# Altium schematic sheet [01]-COVER PAGE.SchDoc: S32K1_CONTROLLER
size A3; SheetNumber: 01; SheetTotal: 11
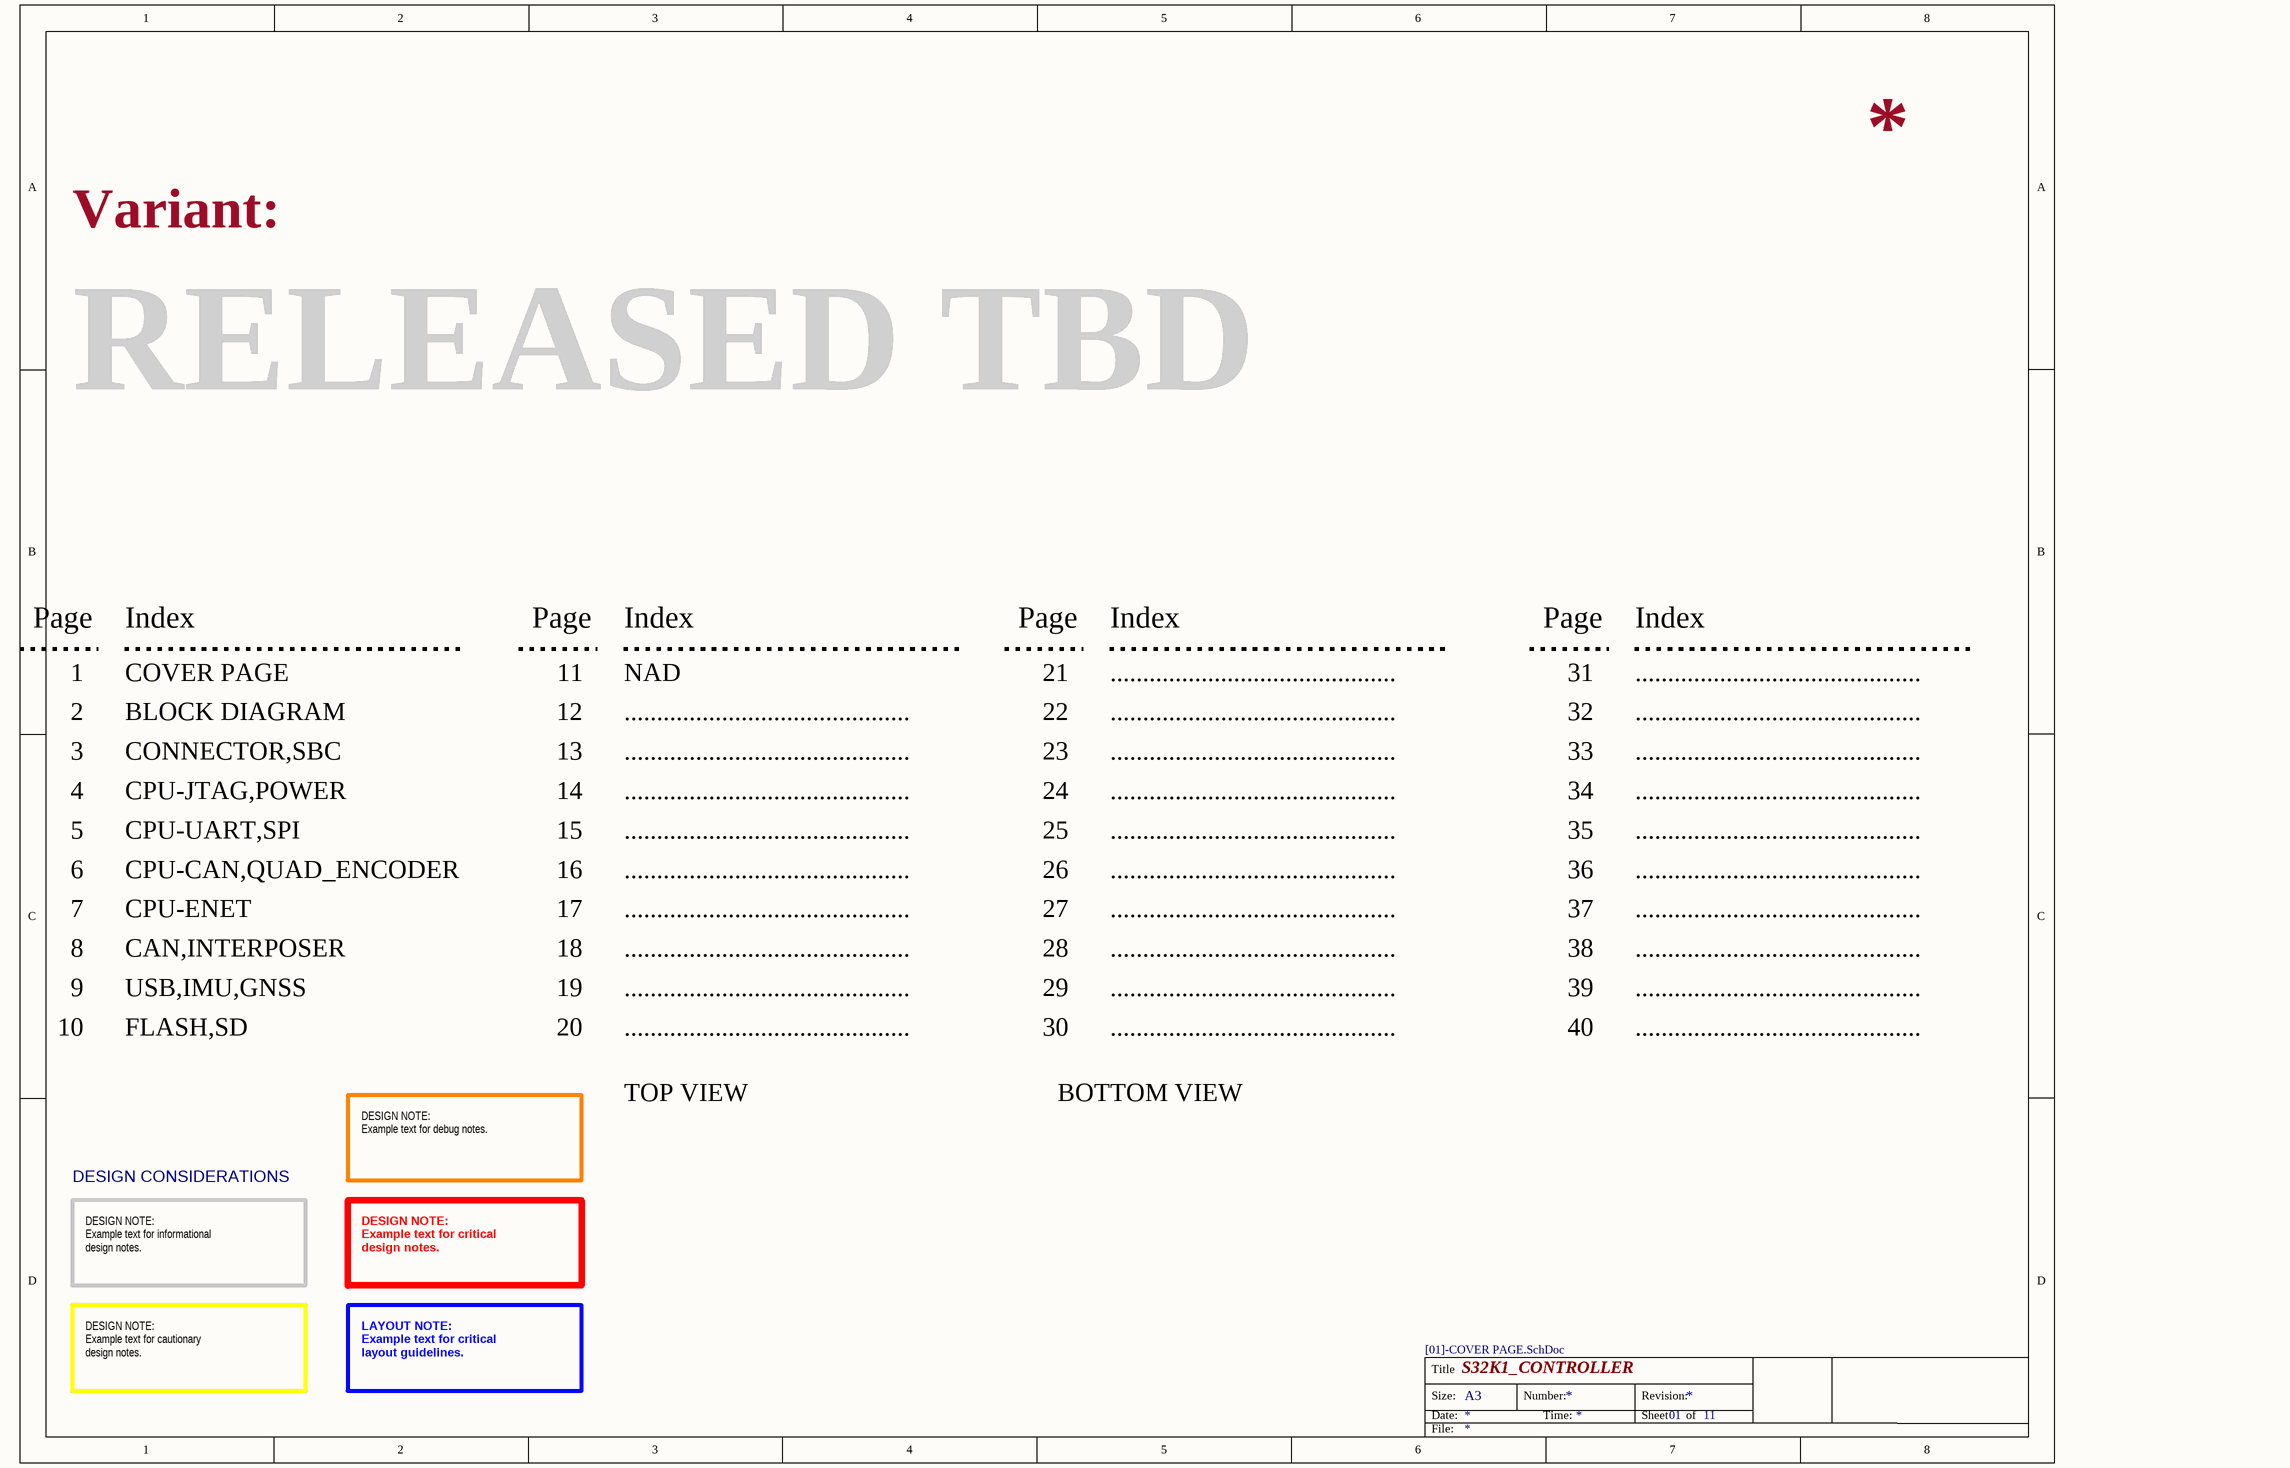
[diagram p0: [01]-COVER PAGE.SchDoc]

## Notes on the sheet
- Variant:
- RELEASED TBD
- Page
- Index
- 1
- COVER PAGE
- 11
- NAD
- 21
- ............................................
- 31
- 2
- 3
- BLOCK DIAGRAM
- CONNECTOR,SBC
- 12
- 13
- 22
- 23
- 32
- 33
- 4
- CPU-JTAG,POWER
- 14
- 24
- 34
- 5
- 6
- CPU-UART,SPI
- CPU-CAN,QUAD_ENCODER
- 15
- 16
- 25
- 26
- 35
- 36
- 7
- 8
- CAN,INTERPOSER
- CPU-ENET
- 17
- 18
- 27
- 28
- 37
- 38
- 9
- USB,IMU,GNSS
- 19
- 29
- 39
- 10
- FLASH,SD
- 20
- 30
- 40
- TOP VIEW
- BOTTOM VIEW
- DESIGN CONSIDERATIONS
- DESIGN NOTE:
  Example text for debug notes.
- DESIGN NOTE:
  Example text for informational
  design notes.
- DESIGN NOTE:
  Example text for critical
  design notes.
- DESIGN NOTE:
  Example text for cautionary
  design notes.
- LAYOUT NOTE:
  Example text for critical
  layout guidelines.
- Title
- Size:
- Date:
- A3
- Number:
- Time:
- Revision:
- Sheet
- of
- File: